# EAGLE design Simple-Transmitter-2N918 (EAGLE 7.7.0)
Simple FM Transmitter for Line-In, using 2N918, an RF NPN Transistor
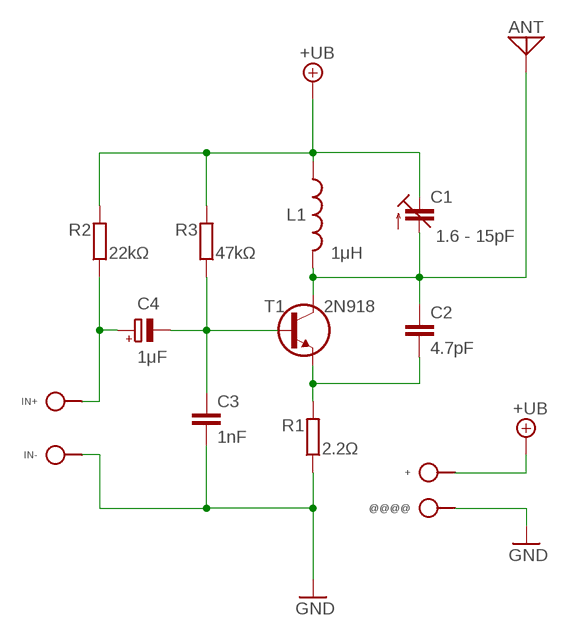
[diagram p0: schematic, sheet 1]

## Parts
+  SPAD  [SPAD]
@@@@  SPAD  [SPAD]
ANT  ANT  [SPAD]
C1  1.6 - 15pF  C-TR-PH201272222-808-2PINB  [TRIM-2222-808]
C2  4.7pF  C025-020X036  [C025-020X036]
C3  1nF  C025-020X036  [C025-020X036]
C4  1μF  CPOLE2,5-3  [E2,5-3]
IN+  SPAD  [SPAD]
IN-  SPAD  [SPAD]
L1  1μH  L04/7  [L-04/7]
R1  2.2Ω  R0202V  [0202V]
R2  22kΩ  R0202/5  [0202/5]
R3  47kΩ  R0202/5  [0202/5]
T1  2N918  2N918TO-72-CE  [TO-72]

## Nets
+UB: +.1 C1.3(A) L1.1 R2.2 R3.2
GND: @@@@.1 C3.2 IN-.1 R1.1
IN+: C4.+ IN+.1 R2.1
N$2: ANT.1 C1.2(E) C2.1 L1.2 T1.3(C)
N$3: C2.2 R1.2 T1.1(E) T1.4(E)
N$5: C3.1 C4.- R3.1 T1.2(B)

## Library data of the parts
+ @@@@ IN+ IN- = pad:SPAD
ANT = pad:ANT
C1 = cap-trim:C-TR-PH20127
C2 C3 = c:C: CAPACITOR, European symbol
C4 = c:CPOL: POLARIZED CAPACITOR, European symbol
L1 = r:L
R1-R3 = r:R: RESISTOR, European symbol
T1 = t:2N918

## Net classes
0 default: width 0.813 mm

## Board
Simple FM Transmitter for Line-In, using 2N918, an RF NPN Transistor
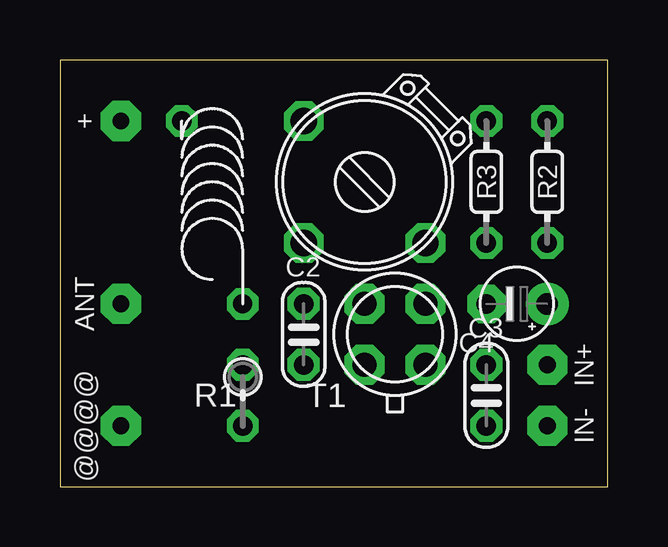
[diagram p1: board, top side]
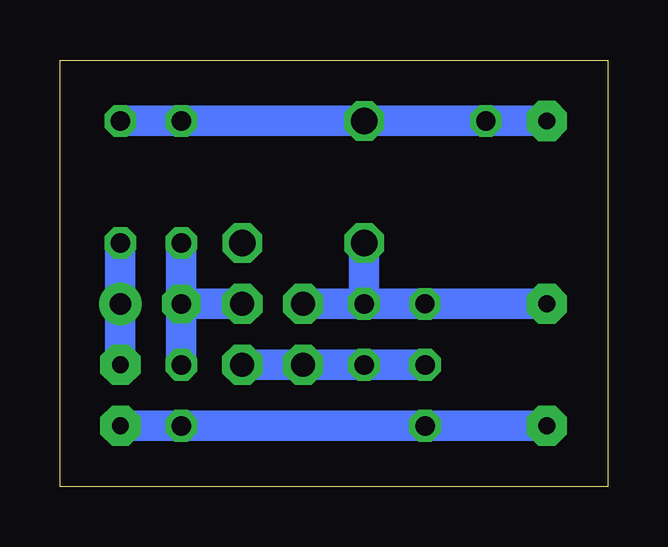
[diagram p2: board, bottom side, seen from below]

Size 22.84 x 17.78 mm. Coordinates in mm from the lower left corner, seen from the top.
Outline: 0,0 22.84,0 22.84,17.78 0,17.78 0,0
Copper layers (1*16): Top 0.035mm / dielectric 1.5mm / Bottom 0.035mm
Design rules "default": minimum track width 10mil, minimum drill 24mil, track to track 8mil, track to pad 8mil, pad to pad 8mil, via to via 8mil, smd to smd 8mil, copper to edge 40mil, drill to drill 8mil, minimum pad ring 10mil, minimum via ring 8mil, stop-mask expansion 4mil, vias tented up to drill 0mil, thermal gap 10mil

### Footprints (pad centres in the part's own frame; a part is rotated, then mirrored left to right if it is on the bottom)
SPAD = drill 0.7 pad 1.676 octagon: 1 0,0
TRIM-2222-808 = drill 1.1 octagon: 1 -2.54,2.54; 2 2.54,2.54; 3 2.54,-2.54
C025-020X036 = drill 0.813 octagon: 1 0,1.27; 2 0,-1.27
E2,5-3 = drill 0.9 pad 1.778: + 1.27,0 | drill 0.813 pad 1.6 octagon: - -1.27,0
L-04/7 = drill 0.8 octagon: 1 -1.27,3.81; 2 1.27,-3.81
0202V = drill 0.813 octagon: 1 0,-1.27; 2 0,1.27
0202/5 = drill 0.813 octagon: 1 0,-2.54; 2 0,2.54
TO-72 = drill 1 pad 1.676 octagon: 1 1.27,-1.27; 2 1.27,1.27; 3 -1.27,1.27; 4 -1.27,-1.27

### Placement (x,y rotation side)
+  2.54,15.24 180 top
@@@@  2.54,2.54 180 top
ANT  2.54,7.62 180 top
C1  12.7,12.7 180 top
C2  10.16,6.35 0 top
C3  17.78,3.81 0 top
C4  19.05,7.62 0 top
IN+  20.32,5.08 0 top
IN-  20.32,2.54 0 top
L1  6.35,11.43 0 top
R1  7.62,3.81 0 top
R2  20.32,12.7 0 top
R3  17.78,12.7 0 top
T1  13.97,6.35 0 top

### Tracks (layer width: path | path; a pad name or v marks a point on that pad's centre or on a via)
+UB
  Bottom 1.27: R2.2 R3.2 C1.3 L1.1 +.1
GND
  Bottom 1.27: @@@@.1 R1.1 C3.2 IN-.1
IN+
  Bottom 1.27: R2.1 C4.+ IN+.1
N$2
  Bottom 1.27: C2.1 L1.2 ANT.1 | T1.3 C2.1 | C2.1 C1.2
N$3
  Bottom 1.27: R1.2 C2.2 T1.4 T1.1
N$5
  Bottom 1.27: R3.1 C4.- | C3.1 C4.- | C4.- T1.2